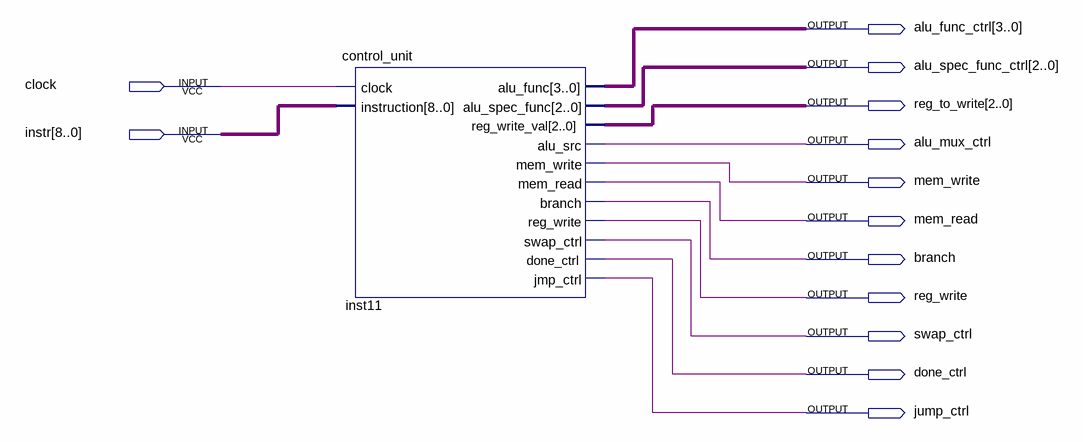
[diagram p0: schematic sheet]
// Quartus schematic control_unit_bench_schematic.bdf as structural Verilog: 1 symbols, 13 pins
module control_unit_bench_schematic (
  input  clock,
  input  [8:0] instr,
  output [3:0] alu_func_ctrl,
  output [2:0] alu_spec_func_ctrl,
  output [2:0] reg_to_write,
  output alu_mux_ctrl,
  output mem_write,
  output mem_read,
  output branch,
  output reg_write,
  output swap_ctrl,
  output done_ctrl,
  output jump_ctrl
);

  control_unit inst11 (
    .clock(clock), .instruction(instr), .alu_func(alu_func_ctrl), .alu_spec_func(alu_spec_func_ctrl),
    .reg_write_val(reg_to_write), .alu_src(alu_mux_ctrl), .mem_write(mem_write), .mem_read(mem_read),
    .branch(branch), .reg_write(reg_write), .swap_ctrl(swap_ctrl), .done_ctrl(done_ctrl), .jmp_ctrl(jump_ctrl));
endmodule
